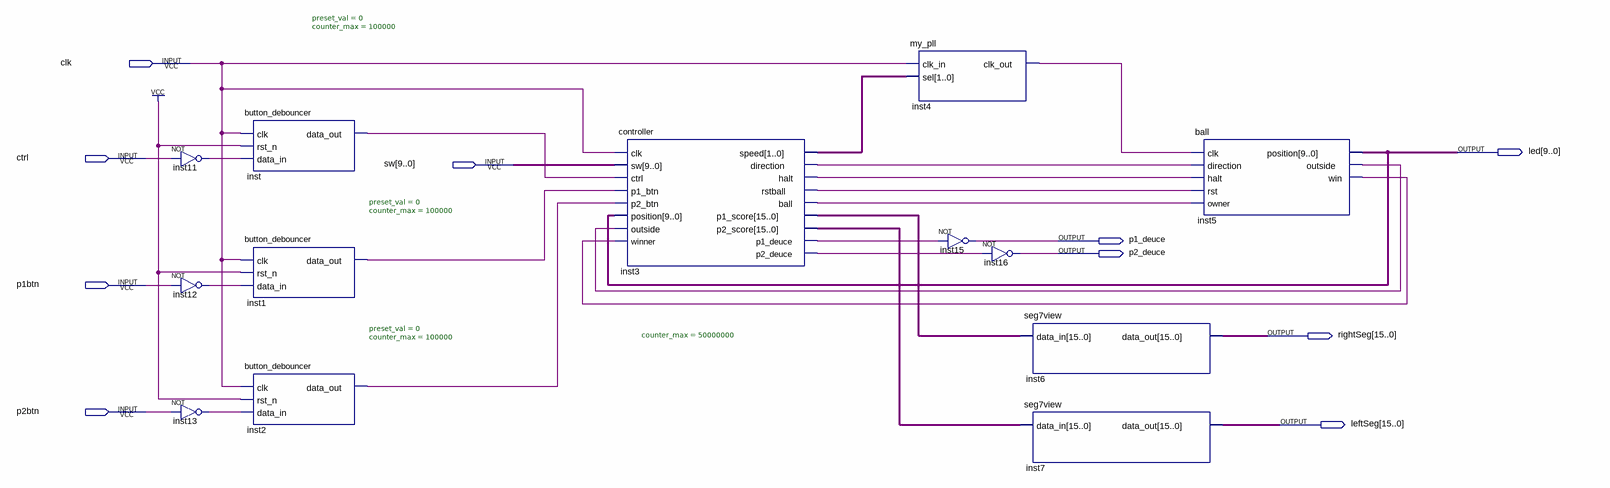
[diagram p0: schematic sheet]
// Quartus schematic lab2.bdf as structural Verilog: 13 symbols, 10 pins
module lab2 (
  input  clk,
  input  ctrl,
  input  [9:0] sw,
  input  p1btn,
  input  p2btn,
  output [9:0] led,
  output p1_deuce,
  output p2_deuce,
  output [15:0] rightSeg,
  output [15:0] leftSeg
);

  wire inst1_data_out, inst2_data_out, inst3_ball, inst3_direction, inst3_halt, inst3_p1_deuce,
       inst3_p2_deuce, inst3_rstball, inst4_clk_out, inst5_outside, inst5_win, inst11_out, inst12_out,
       inst13_out, inst_data_out;
  wire [1:0] inst3_speed;
  wire [15:0] inst3_p1_score, inst3_p2_score;

  not inst11 (inst11_out, ctrl);
  not inst12 (inst12_out, p1btn);
  not inst13 (inst13_out, p2btn);
  button_debouncer #(.preset_val(0), .counter_max(100000)) inst (
    .clk(clk), .rst_n(1'b1), .data_in(inst11_out), .data_out(inst_data_out));
  button_debouncer #(.preset_val(0), .counter_max(100000)) inst1 (
    .clk(clk), .rst_n(1'b1), .data_in(inst12_out), .data_out(inst1_data_out));
  button_debouncer #(.preset_val(0), .counter_max(100000)) inst2 (
    .clk(clk), .rst_n(1'b1), .data_in(inst13_out), .data_out(inst2_data_out));
  controller #(.counter_max(50000000)) inst3 (
    .clk(clk), .sw(sw), .ctrl(inst_data_out), .p1_btn(inst1_data_out), .p2_btn(inst2_data_out),
    .position(led), .outside(inst5_outside), .winner(inst5_win), .speed(inst3_speed),
    .direction(inst3_direction), .halt(inst3_halt), .rstball(inst3_rstball), .ball(inst3_ball),
    .p1_score(inst3_p1_score), .p2_score(inst3_p2_score), .p1_deuce(inst3_p1_deuce), .p2_deuce(inst3_p2_deuce));
  my_pll inst4 (.clk_in(clk), .sel(inst3_speed), .clk_out(inst4_clk_out));
  not inst15 (p1_deuce, inst3_p1_deuce);
  not inst16 (p2_deuce, inst3_p2_deuce);
  seg7view inst6 (.data_in(inst3_p1_score), .data_out(rightSeg));
  seg7view inst7 (.data_in(inst3_p2_score), .data_out(leftSeg));
  ball inst5 (
    .clk(inst4_clk_out), .direction(inst3_direction), .halt(inst3_halt), .rst(inst3_rstball),
    .owner(inst3_ball), .position(led), .outside(inst5_outside), .win(inst5_win));
endmodule
